# EAGLE schematic ESPFA (EAGLE 9.6.1)
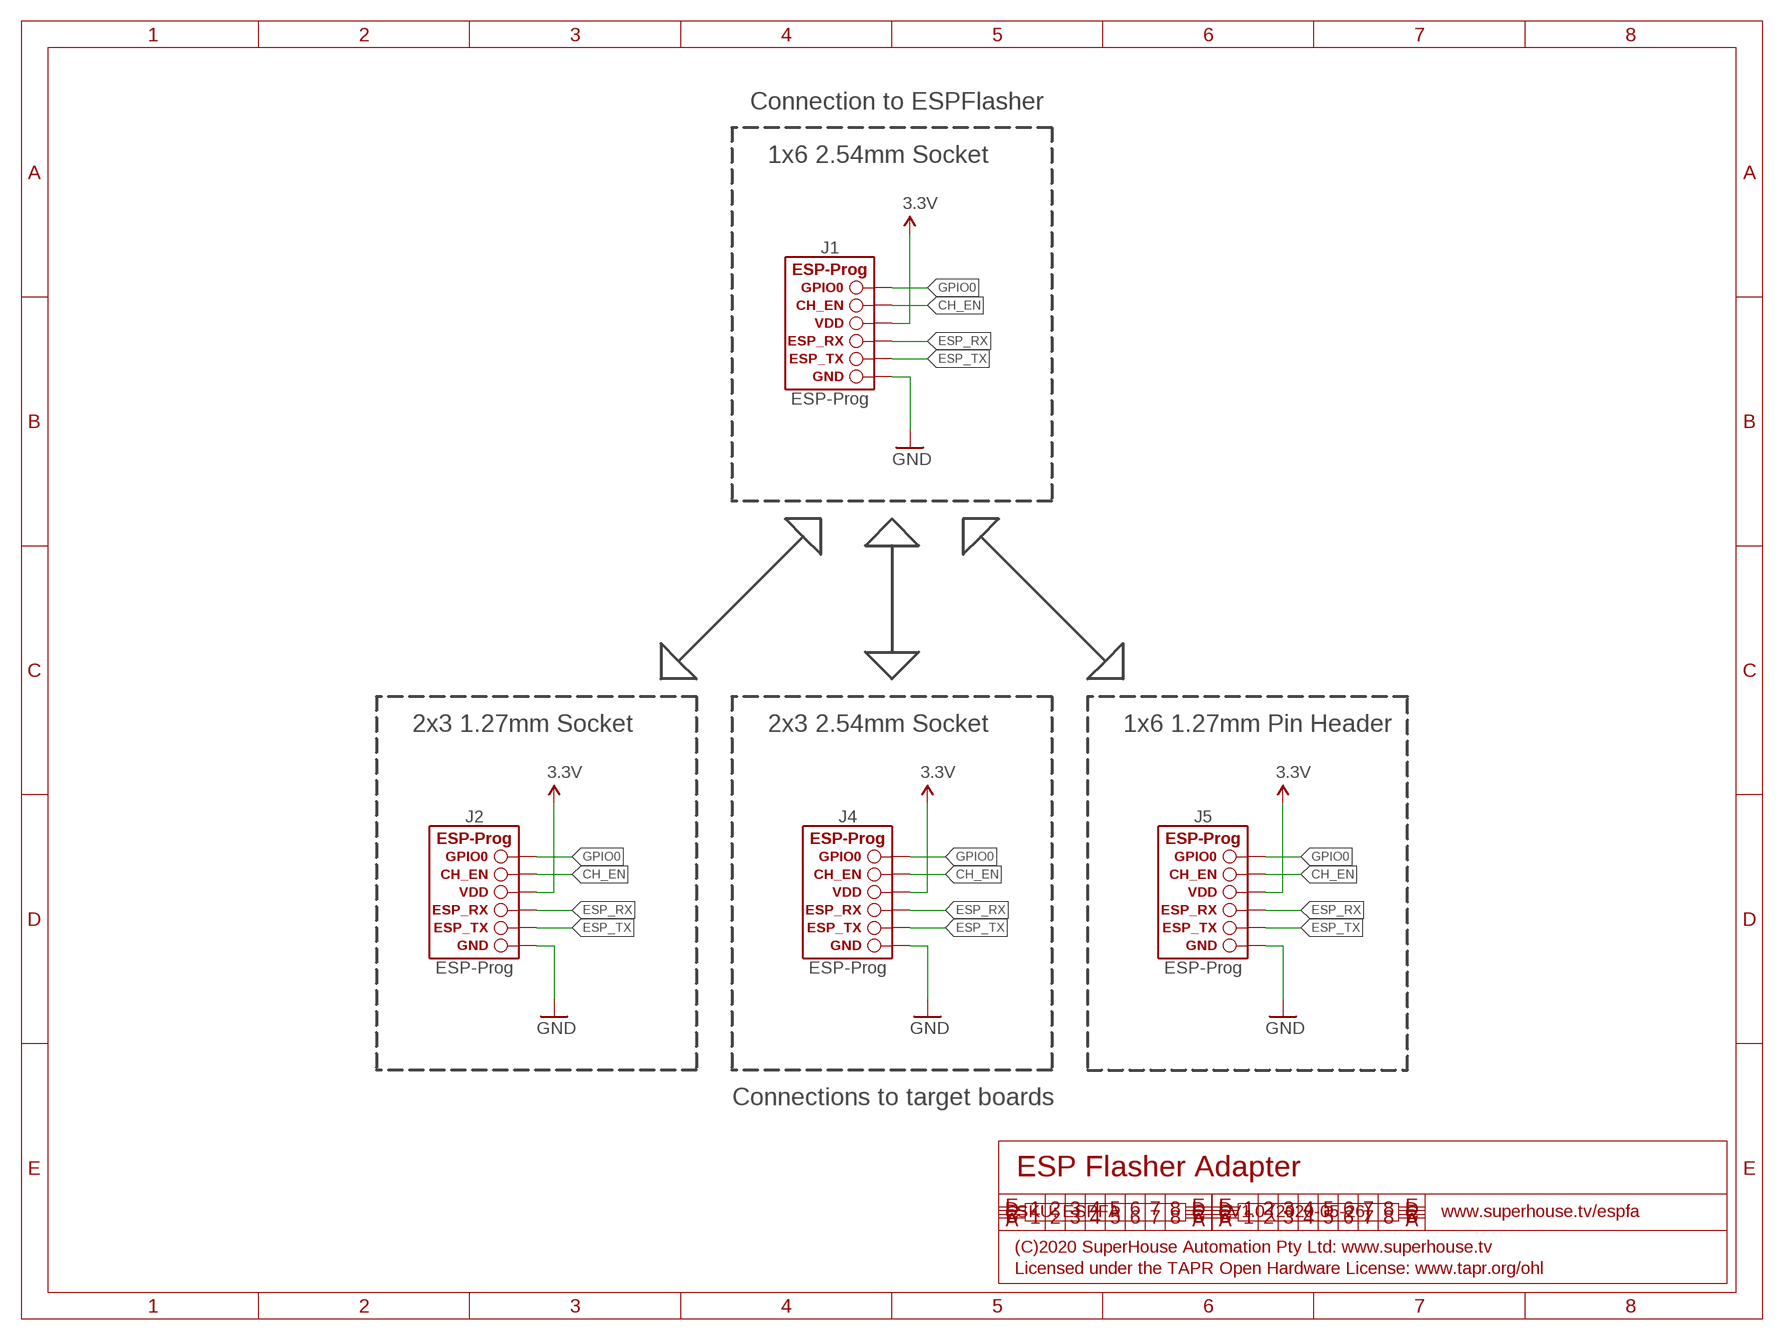
[diagram p0: schematic, sheet 1]

## Parts
J1  ESP-PROG-1X6-2.54-SOCKET-RA  [1X6-2.54-SOCKET-RA]
J2  ESP-PROG-2X3-1.27-SHROUDED  [2X3-1.27-SHROUDED]
J4  ESP-PROG-2X3-2.54-SHROUDED  [2X3-2.54-SHROUDED]
J5  ESP-PROG-1X6-1.27-PINS-RA  [1X6-1.27-PINS-RA]

## Nets
3.3V: J1.4(VDD) J2.2(VDD) J4.2(VDD) J5.4(VDD)
CH_EN: J1.5(CH_EN) J2.1(CH_EN) J4.1(CH_EN) J5.5(CH_EN)
ESP_RX: J1.3(ESP_RX) J2.5(ESP_RX) J4.5(ESP_RX) J5.3(ESP_RX)
ESP_TX: J1.2(ESP_TX) J2.3(ESP_TX) J4.3(ESP_TX) J5.2(ESP_TX)
GND: J1.1(GND) J2.4(GND) J4.4(GND) J5.1(GND)
GPIO0: J1.6(GPIO0) J2.6(GPIO0) J4.6(GPIO0) J5.6(GPIO0)

## Notes on the sheet
- Connection to ESPFlasher
- 1x6 2.54mm Socket
- 2x3 1.27mm Socket | 2x3 2.54mm Socket | 1x6 1.27mm Pin Header
- Connections to target boards
- ESP Flasher Adapter
- SKU: ESPFA | V1.0 (2020-05-26) | www.superhouse.tv/espfa
- (C)2020 SuperHouse Automation Pty Ltd: www.superhouse.tv
- Licensed under the TAPR Open Hardware License: www.tapr.org/ohl

## Library data of the parts
J1 J2 J4 J5 = SuperHouse-ESP-Prog:ESP-PROG: ESP-Prog ESP-Prog programming header for ESP8266, ESP8285, and ESP32. Options for both 1x6 and 2x3 formats, in 2.54mm (0.1") and 1.27mm (0.05") pitch.

## Net classes
0 default: width 0.152 mm, drill 0.241 mm, clearance 0.152 mm